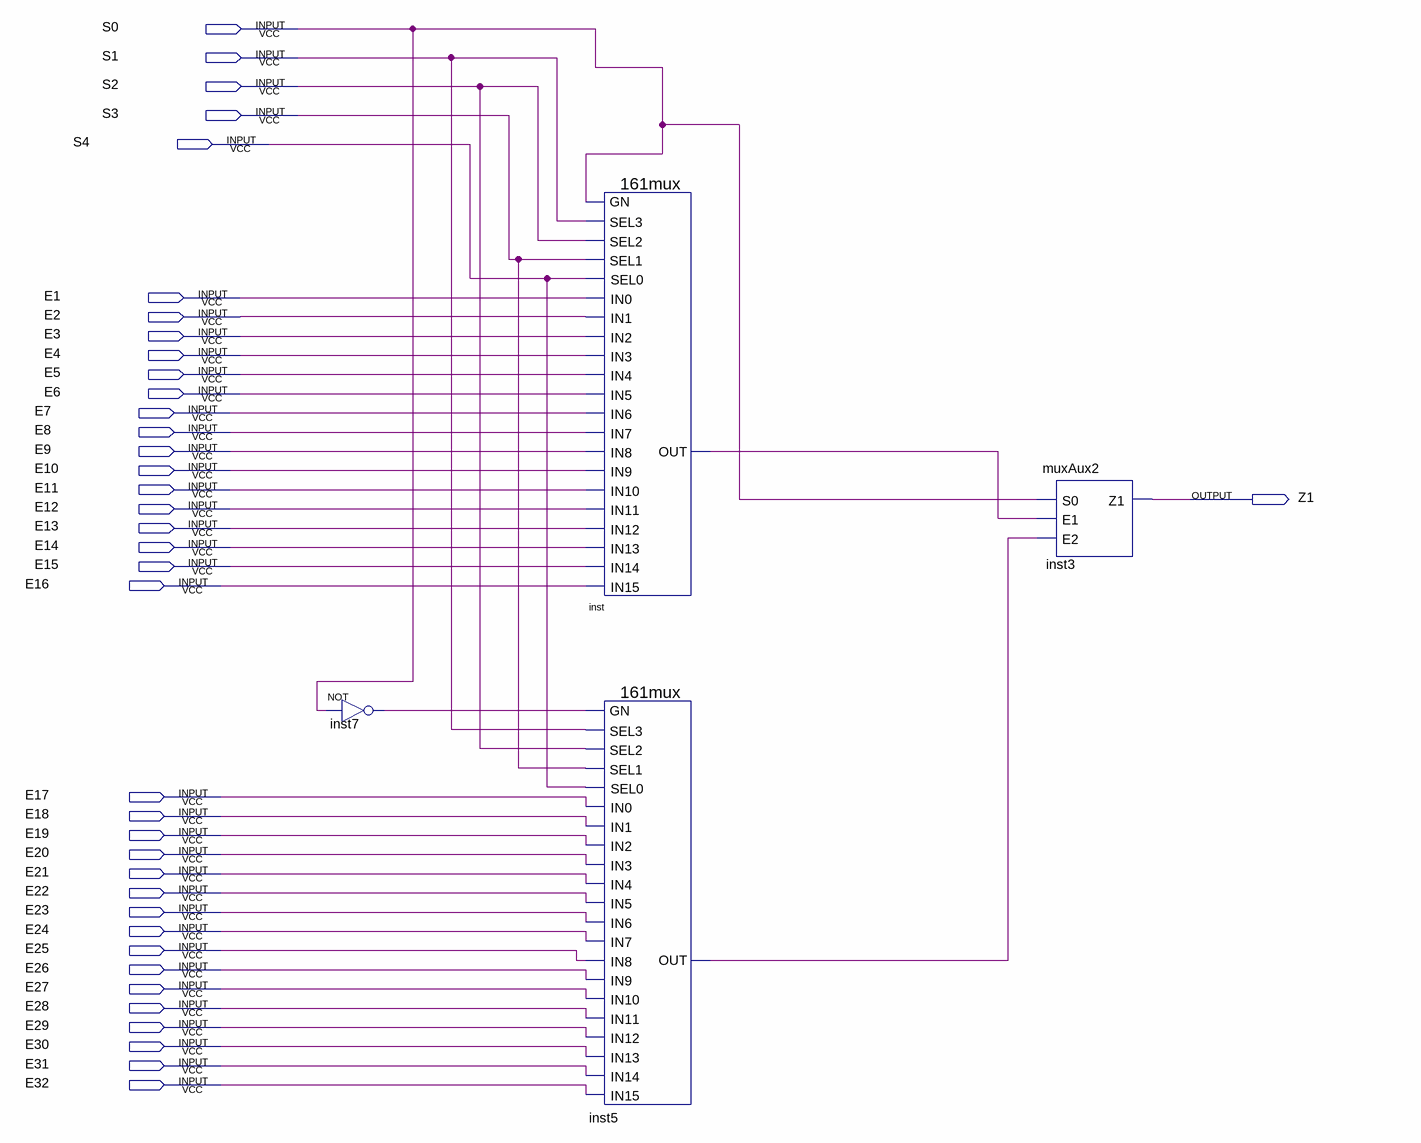
[diagram p0: schematic sheet]
// Quartus schematic muxAux1.bdf as structural Verilog: 4 symbols, 38 pins
module muxAux1 (
  input  S0,
  input  S1,
  input  S2,
  input  S3,
  input  S4,
  input  E1,
  input  E2,
  input  E3,
  input  E4,
  input  E5,
  input  E6,
  input  E7,
  input  E8,
  input  E9,
  input  E10,
  input  E11,
  input  E12,
  input  E13,
  input  E14,
  input  E15,
  input  E16,
  input  E17,
  input  E18,
  input  E19,
  input  E20,
  input  E21,
  input  E22,
  input  E23,
  input  E24,
  input  E25,
  input  E26,
  input  E27,
  input  E28,
  input  E29,
  input  E30,
  input  E31,
  input  E32,
  output Z1
);

  wire inst5_out, inst7_out, inst_out;

  not inst7 (inst7_out, S0);
  \161mux  inst (
    .SEL3(S1), .GN(S0), .IN0(E1), .SEL0(S4), .SEL1(S3), .SEL2(S2), .IN3(E4), .IN2(E3), .IN1(E2), .IN6(E7),
    .IN5(E6), .IN4(E5), .IN9(E10), .IN8(E9), .IN7(E8), .IN11(E12), .IN12(E13), .IN10(E11), .IN15(E16),
    .IN14(E15), .IN13(E14), .OUT(inst_out));
  \161mux  inst5 (
    .SEL3(S1), .GN(inst7_out), .IN0(E17), .SEL0(S4), .SEL1(S3), .SEL2(S2), .IN3(E20), .IN2(E19), .IN1(E18),
    .IN6(E23), .IN5(E22), .IN4(E21), .IN9(E26), .IN8(E25), .IN7(E24), .IN11(E28), .IN12(E29), .IN10(E27),
    .IN15(E32), .IN14(E31), .IN13(E30), .OUT(inst5_out));
  muxAux2 inst3 (.S0(S0), .E1(inst_out), .E2(inst5_out), .Z1(Z1));
endmodule
